# Altium schematic sheet microcontroller.SchDoc
size A4
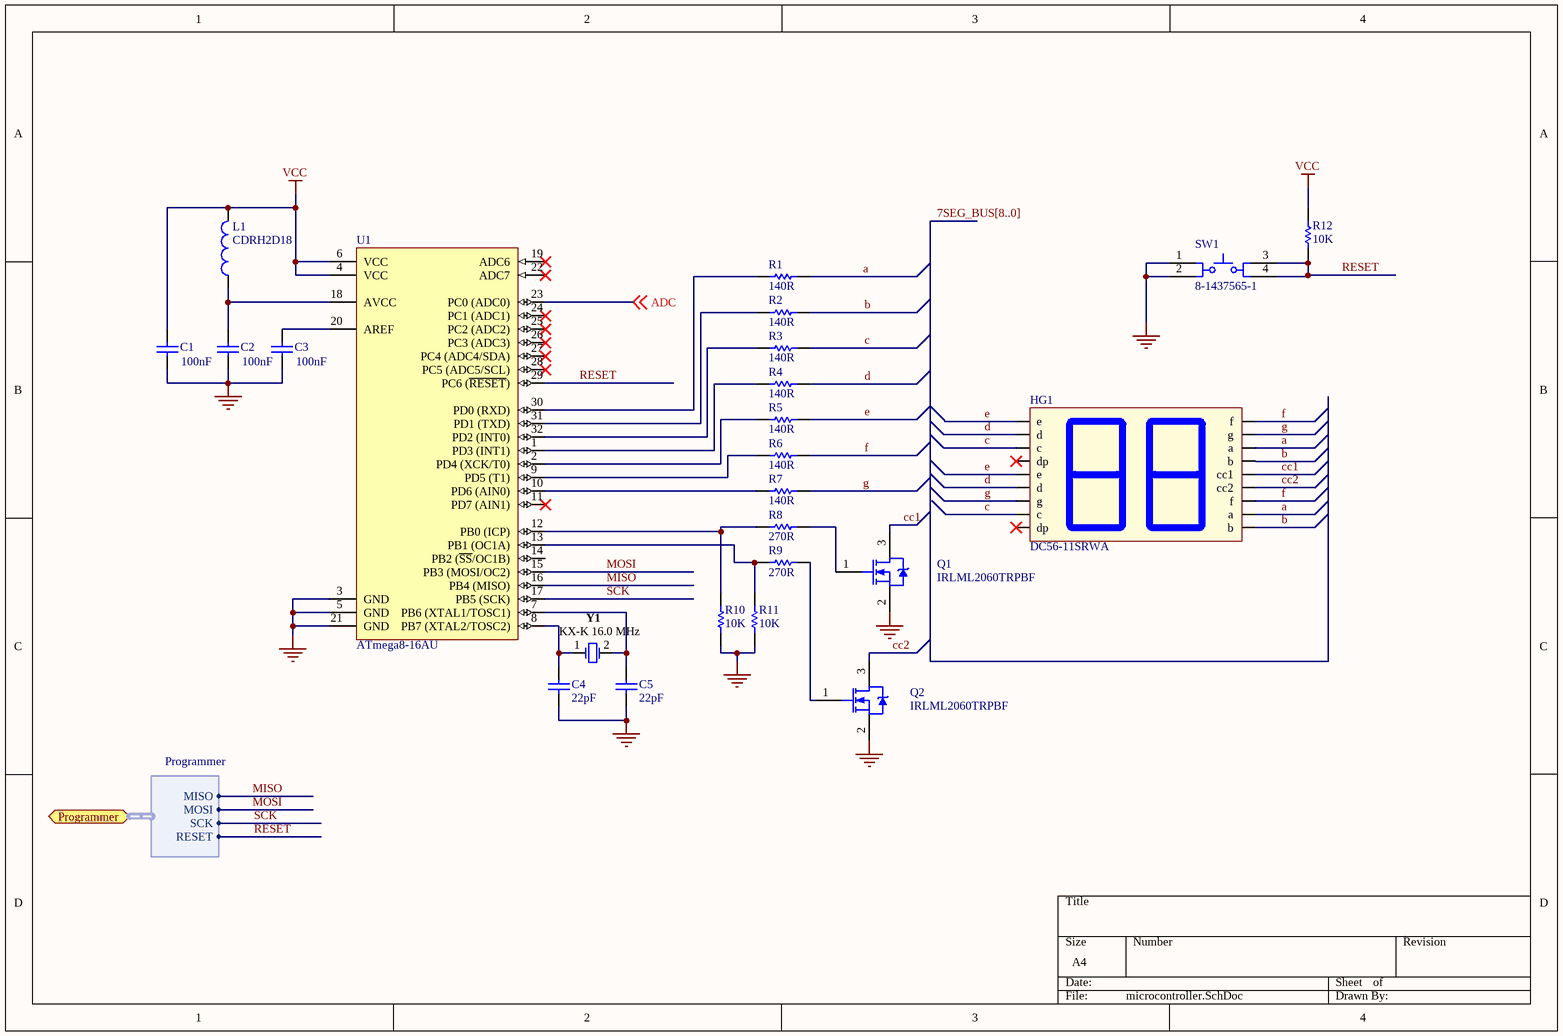
[diagram p0: microcontroller.SchDoc]

## Parts
C1  100nF  [CAPC0805(2012)75_M]
C2  100nF  [CAPC0805(2012)75_M]
C3  100nF  [CAPC0805(2012)75_M]
C4  22pF  [CAPC0805(2012)100_M]
C5  22pF  [CAPC0805(2012)100_M]
HG1  DC56-11SRWA  [7seg_LCD]
L1  CDRH2D18  [SUMI-CDRH2D14NP-1R5NC-2_V]
Q1  IRLML2060TRPBF  [INTR-IRLML2402TRPBF-3_V]
Q2  IRLML2060TRPBF  [INTR-IRLML2402TRPBF-3_V]
R1  140R  [RESC0805(2012)_M]
R2  140R  [RESC0805(2012)_M]
R3  140R  [RESC0805(2012)_M]
R4  140R  [RESC0805(2012)_M]
R5  140R  [RESC0805(2012)_M]
R6  140R  [RESC0805(2012)_M]
R7  140R  [RESC0805(2012)_M]
R8  270R  [RESC0805(2012)_M]
R9  270R  [RESC0805(2012)_M]
R10  10K  [RESC0805(2012)_M]
R11  10K  [RESC0805(2012)_M]
R12  10K  [RESC0805(2012)_M]
SW1  8-1437565-1  [SW-SPST-NO-4]
U1  ATmega8-16AU  [32A_L]
Y1  KX-K 16.0 MHz  [FOX-HC49SDLF_V]

## Ports
Programmer (harness Programmer)

## Harnesses
Programmer: MISO, MOSI, SCK, RESET

## Nets
GND: C1.1 C2.1 C3.1 C4.1 C5.1 Q1.2(S) Q2.2(S) R10.1 R11.1 SW1.1 SW1.2 U1.3(GND) U1.5(GND) U1.21(GND)
VCC: C1.2 L1.2 R12.2 U1.4(VCC) U1.6(VCC)
a: HG1.11(a) HG1.16(a) R1.2
ADC: U1.23(PC0_(ADC0)) ; off-sheet ADC
b: HG1.10(b) HG1.15(b) R2.2
c: HG1.3(c) HG1.8(c) R3.2
cc1: HG1.14(cc1) Q1.3(D)
cc2: HG1.13(cc2) Q2.3(D)
d: HG1.2(d) HG1.6(d) R4.2
e: HG1.1(e) HG1.5(e) R5.2
f: HG1.12(f) HG1.18(f) R6.2
g: HG1.7(g) HG1.17(g) R7.2
MISO: U1.16(PB4_(MISO)) ; port Programmer.MISO
MOSI: U1.15(PB3_(MOSI/OC2)) ; port Programmer.MOSI
RESET: R12.1 SW1.3 SW1.4 U1.29(PC6_(~{RESET})) ; port Programmer.RESET
SCK: U1.17(PB5_(SCK)) ; port Programmer.SCK
NetC2_2: C2.2 L1.1 U1.18(AVCC)
NetC3_2: C3.2 U1.20(AREF)
NetC4_2: C4.2 U1.8(PB7_(XTAL2/TOSC2)) Y1.1
NetC5_2: C5.2 U1.7(PB6_(XTAL1/TOSC1)) Y1.2
NetQ1_1: Q1.1(G) R8.2
NetQ2_1: Q2.1(G) R9.2
NetR1_1: R1.1 U1.30(PD0_(RXD))
NetR2_1: R2.1 U1.31(PD1_(TXD))
NetR3_1: R3.1 U1.32(PD2_(INT0))
NetR4_1: R4.1 U1.1(PD3_(INT1))
NetR5_1: R5.1 U1.2(PD4_(XCK/T0))
NetR6_1: R6.1 U1.9(PD5_(T1))
NetR7_1: R7.1 U1.10(PD6_(AIN0))
NetR8_1: R8.1 R10.2 U1.12(PB0_(ICP))
NetR9_1: R9.1 R11.2 U1.13(PB1_(OC1A))

Not connected (* = marked no-connect by the designer): HG1 4(dp)* 9(dp)*; U1 11(PD7_(AIN1))* 14(PB2_(~{SS}/OC1B)) 19(ADC6)* 22(ADC7)* 24(PC1_(ADC1))* 25(PC2_(ADC2))* 26(PC3_(ADC3))* 27(PC4_(ADC4/SDA))* 28(PC5_(ADC5/SCL))*

## Buses and harness runs
bus 7SEG_BUS[8..0]

## Library data of the parts
C1-C3 = CMP-1036-04403-1: CAP 100nF 16V ±20% 0805 (2012 Metric) Thickness 0.75mm SMD; Case-EIA: 0805; Tolerance: Â±20%; Case-Metric: 2012; Rated Voltage: 16 V; Value: 100nF; Technology: SMT; Max Thickness: 0.75 mm
C4 C5 = CMP-1036-01214-1: CAP 22pF 16V ±0.25pF 0805 (2012 Metric) Thickness 1mm SMD; Case-EIA: 0805; Tolerance: Â±0.25pF; Case-Metric: 2012; Technology: SMT; Value: 22pF; Max Thickness: 1 mm; Rated Voltage: 16 V
HG1 = Component_1
L1 = CMP-0468-00001-2: Power Inductor,-40 to 100 degC, 3.2 x 3.2 x 1.55 mm, SMD; PartNumber: CDRH2D14NP-1R5NC; Manufacturer: Sumida; Saturation Current(A)at 20 degC: 1.8; Stamp: A; Inductance(uH)[within]: 1.5+/- 30%; Saturation Current(A)at 100degC: 1.2; Temperature Rise Current(A): 2; Packing: Tape and Reel; D.C.R.(mOhm) Max.(Typ.)(at 20 degC): 63(50); ComponentLink1URL: http://www.sumida.com; DatasheetVersion: 17.09.12; ComponentLink2Description: Datasheet; ComponentLink2URL: http://www.sumida.com/products/pdf/CDRH2D14.pdf; ComponentLink3URL: http://www.sumida.com/products/pdf/CDRH2D14.pdf; ComponentLink1Description: Manufacturer URL; ComponentLink3Description: Package Specification; Mounting Technology: Surface Mount; Operating Temperature range: -40 to 100 degC; PackageDescription: 2-Pin Hand Drawn, Body 3 x 3mm, Pitch 3 mm; PackageReference: CDRH2D14NP-1R5NC-2
Q1 Q2 = CMP-2000-05155-1: HEXFET(R) Power MOSFET, N-Channel, 20 V, 1.2 A, 3-Pin SOT-23, RoHS, Tape and Reel; Manufacturer: International Rectifier; Voltage Vgs Rds on Measurement: 4.5V; Current Id Max: 1.2A; External Width: 3.05mm; Transistor Polarity: NChannel; No. of Pins: 3; Power Dissipation Pd: 540mW; External Length / Height: 1.12mm; Full Power Rating Temperature: 25degC; On Resistance Rds(on): 250mohm; Voltage Vds Typ: 20V; SMD Marking: 1A; No. of Transistors: 1; Reel Quantity: 3000; External Depth: 2.5mm; Pulse Current Idm: 7.4A; Junction Temperature Tj Min: -55degC; Threshold Voltage Vgs Typ: 700mV; SVHC: NoSVHC(19-Dec-2012); Datasheet URL: https://datasheet.ciiva.com/29326/162826-da-01-en-irlml-2402tr-29326791.pdf; Tape Width: 8mm; Operating Temperature Range: -55degCto+150degC; Manufacturer URL: http://internationalrectifier.com/; Termination Type: SMD; Datasheet Version: Jan-03; Current Temperature: 25degC; Package / Case: SOT-23; Drain Source Voltage Vds: 20V; Rds(on) Test Voltage Vgs: 4.5V; Continuous Drain Current Id: 1.2A; Transistor Case Style: SOT-23; Voltage Vgs th Min: 700mV; Voltage Vgs Max: 700mV
R1-R7 = CMP-1013-00412-1: 140R 0.125W 1% 0805 (2012 Metric)  SMD; Value: 140.00 Ohm; Case-Metric: 2012; Case-EIA: 0805; Power: 0.125 W; Technology: SMT; Tolerance: 1 %
R8 R9 = CMP-1013-00060-1: 270R 0.125W 5% 0805 (2012 Metric)  SMD; Value: 270.00 Ohm; Case-Metric: 2012; Case-EIA: 0805; Power: 0.125 W; Technology: SMT; Tolerance: 5 %
R10-R12 = CMP-1013-00098-1: 10K 0.125W 5% 0805 (2012 Metric)  SMD; Case-EIA: 0805; Case-Metric: 2012; Value: 10000.00 Ohm; Power: 0.125 W; Technology: SMT; Tolerance: 5 %
SW1 = SW-SPST-NO-4
U1 = CMP-0095-00565-1: 8-bit AVR Microcontroller, 4.5-5.5V, 16MHz, 8KB Flash, 512 Bytes EEPROM, 1KB SRAM, 32-pin TQFP, Industrial Grade (-40°C to 85°C); ComponentLink3Description: ATmega8(L) Summary; ComponentLink1Description: Manufacturer URL; ComponentLink2Description: ATmega8(L); DatasheetVersion: revZ, Feb-2011; PackageReference: 32A; ComponentLink2URL: http://www.atmel.com/dyn/resources/prod_documents/doc2486.pdf; ComponentLink1URL: http://www.atmel.com/; Code_JEDEC: MS-026-ABA; PackageDescription: 32-Lead, 7x7x1.0 mm Body, 0.8mm Lead Pitch, Thin Profile Plastic Quad Flat Package (TQFP); ComponentLink3URL: http://www.atmel.com/dyn/resources/prod_documents/2486S.pdf; PackageVersion: revC, Oct-2010
Y1 = CMP-2100-03639-1: Resistance Weld Crystal, 8 MHz, +/- 30 ppm, -20 to 70 degC, 2-Pin SMD, RoHS, Tape and Reel; Manufacturer: FOX Electronics; Series Resistance: 80Ohm; Frequency: 8MHz; Load Capacitance: 20pF; Tolerance: 50ppm; Frequency Tolerance: 30ppm; Datasheet URL: http://www.foxonline.com/pdfs/hc49sdlf.pdf; Package Reference: HC49SDLF; Height: 4.5mm; Mount: SurfaceMount; Packaging: TapeandReel; Length: 11.7mm; Termination: SMD/SMT; Number of Pins: 2; Depth: 5mm; Min Operating Temperature: -20degC; Package Quantity: 1000; RoHSCompliant: True; Lead Free: LeadFree; Width: 5mm; Case/Package: SMD/SMT; Manufacturer URL: http://www.foxonline.com/; Max Operating Temperature: 70degC; REACH SVHC: NoSVHC; Datasheet Version: 42064.0; Package Description: 2-Pin Surface Mount Device, Body 5 x 11.7 mm; Frequency Stability: 50ppm; ESR (Equivalent Series Resistance): 80Ohm; Radiation Hardening: No